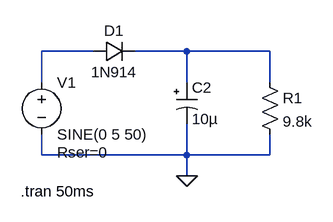
[diagram p0: schematic 1 period.asc]
1 period.asc, the LTspice schematic file:
Version 4
SHEET 1 880 680
WIRE 32 96 -48 96
WIRE 176 96 96 96
WIRE 304 96 176 96
WIRE -48 144 -48 96
WIRE 176 144 176 96
WIRE 304 144 304 96
WIRE -48 256 -48 224
WIRE 176 256 176 208
WIRE 176 256 -48 256
WIRE 304 256 304 224
WIRE 304 256 176 256
WIRE 176 288 176 256
FLAG 176 288 0
SYMBOL voltage -48 128 R0
WINDOW 123 0 0 Left 2
WINDOW 39 24 124 Left 2
SYMATTR SpiceLine Rser=0
SYMATTR InstName V1
SYMATTR Value SINE(0 5 50)
SYMBOL diode 32 112 R270
WINDOW 0 32 32 VTop 2
WINDOW 3 0 32 VBottom 2
SYMATTR InstName D1
SYMATTR Value 1N914
SYMBOL res 288 128 R0
SYMATTR InstName R1
SYMATTR Value 9.8k
SYMBOL polcap 160 144 R0
SYMATTR InstName C2
SYMATTR Value 10µ
TEXT -80 312 Left 2 !.tran 50ms

The netlist it stands for:
* 1 period.asc
V1 N001 0 SINE(0 5 50) Rser=0
D1 N001 N002 1N914
R1 N002 0 9.8k
C2 N002 0 10µ
.model D D
.lib standard.dio
.tran 50ms
.backanno
.end